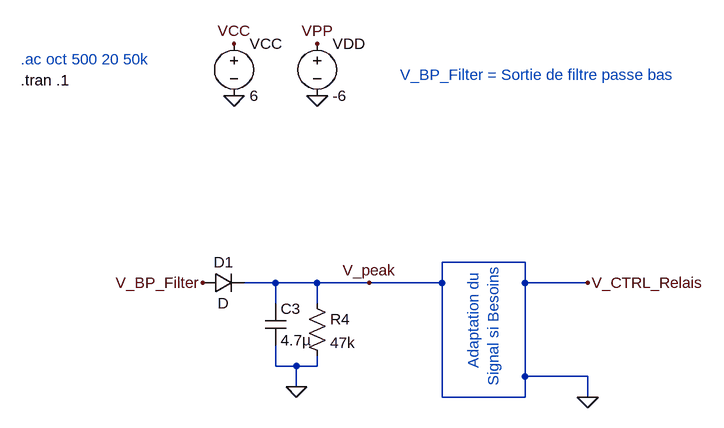
[diagram p0: schematic Detection_de_Niveau__Adaptation_de_Niveau.asc]
Detection_de_Niveau__Adaptation_de_Niveau.asc, the LTspice schematic file:
Version 4
SHEET 1 3580 680
WIRE 1120 96 992 96
WIRE 736 128 688 128
WIRE 800 128 736 128
WIRE 880 128 800 128
WIRE 992 128 992 96
WIRE 992 128 880 128
WIRE 1120 128 1120 96
WIRE 1216 128 1120 128
WIRE 736 160 736 128
WIRE 800 160 800 128
WIRE 736 256 736 224
WIRE 768 256 736 256
WIRE 800 256 800 240
WIRE 800 256 768 256
WIRE 1120 272 1120 128
WIRE 1216 272 1120 272
WIRE 768 288 768 256
WIRE 992 304 992 128
WIRE 1120 304 1120 272
WIRE 1120 304 992 304
WIRE 1216 304 1216 272
FLAG 672 -160 0
FLAG 800 -160 0
FLAG 672 -240 VCC
FLAG 800 -240 VPP
FLAG 624 128 V_BP_Filter
FLAG 768 288 0
FLAG 880 128 V_peak
FLAG 1216 304 0
FLAG 1216 128 V_CTRL_Relais
SYMBOL voltage 672 -256 R0
WINDOW 123 0 0 Left 0
WINDOW 39 0 0 Left 0
SYMATTR InstName VCC
SYMATTR Value 6
SYMBOL voltage 800 -256 R0
WINDOW 123 0 0 Left 0
WINDOW 39 0 0 Left 0
SYMATTR InstName VDD
SYMATTR Value -6
SYMBOL res 784 144 R0
SYMATTR InstName R4
SYMATTR Value 47k
SYMBOL cap 720 160 R0
SYMATTR InstName C3
SYMATTR Value 4.7µ
SYMBOL diode 624 144 R270
WINDOW 0 32 32 VTop 2
WINDOW 3 0 32 VBottom 2
SYMATTR InstName D1
TEXT 344 -216 Left 2 ;.ac oct 500 20 50k
TEXT 344 -184 Left 2 !.tran .1
TEXT 1040 104 VRight 2 ;Adaptation du \nSignal si Besoins
TEXT 928 -192 Left 2 ;V_BP_Filter = Sortie de filtre passe bas

The netlist it stands for:
* Detection_de_Niveau__Adaptation_de_Niveau.asc
VCC VCC 0 6
VDD VPP 0 -6
R4 0 0 47k
C3 0 0 4.7µ
D1 V_BP_Filter 0 D
.model D D
.lib standard.dio
* .ac oct 500 20 50k
.tran .1
* Adaptation du
* Signal si Besoins
* V_BP_Filter = Sortie de filtre passe bas
.backanno
.end